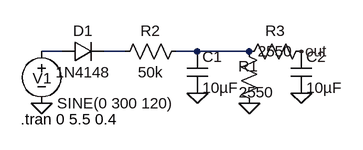
[diagram p0: schematic ac_voltage_sense.asc]
ac_voltage_sense.asc, the LTspice schematic file:
Version 4
SHEET 1 880 680
WIRE 32 112 0 112
WIRE 128 112 96 112
WIRE 240 112 208 112
WIRE 320 112 240 112
FLAG 0 192 0
FLAG 320 192 0
FLAG 240 176 0
FLAG 400 112 out
FLAG 400 176 0
SYMBOL voltage 0 96 R0
WINDOW 123 0 0 Left 2
WINDOW 39 0 0 Left 2
WINDOW 0 -14 57 Left 2
SYMATTR InstName V1
SYMATTR Value SINE(0 300 120)
SYMBOL res 304 96 R0
WINDOW 0 -1 39 Left 2
WINDOW 3 0 79 Left 2
SYMATTR InstName R1
SYMATTR Value 2550
SYMBOL res 112 128 R270
WINDOW 0 32 56 VTop 2
WINDOW 3 0 56 VBottom 2
SYMATTR InstName R2
SYMATTR Value 50k
SYMBOL diode 32 128 R270
WINDOW 0 32 32 VTop 2
WINDOW 3 0 32 VBottom 2
SYMATTR InstName D1
SYMATTR Value 1N4148
SYMBOL cap 224 112 R0
SYMATTR InstName C1
SYMATTR Value 10µF
SYMBOL cap 384 112 R0
SYMATTR InstName C2
SYMATTR Value 10µF
SYMBOL res 304 128 R270
WINDOW 0 32 56 VTop 2
WINDOW 3 32 56 VBottom 2
SYMATTR InstName R3
SYMATTR Value 2550
TEXT -32 216 Left 2 !.tran 0 5.5 0.4

The netlist it stands for:
* ac_voltage_sense.asc
V1 N001 0 SINE(0 300 120)
R1 N003 0 2550
R2 N002 N003 50k
D1 N001 N002 1N4148
C1 N003 0 10µF
C2 out 0 10µF
R3 N003 out 2550
.model D D
.lib standard.dio
.tran 0 5.5 0.4
.backanno
.end